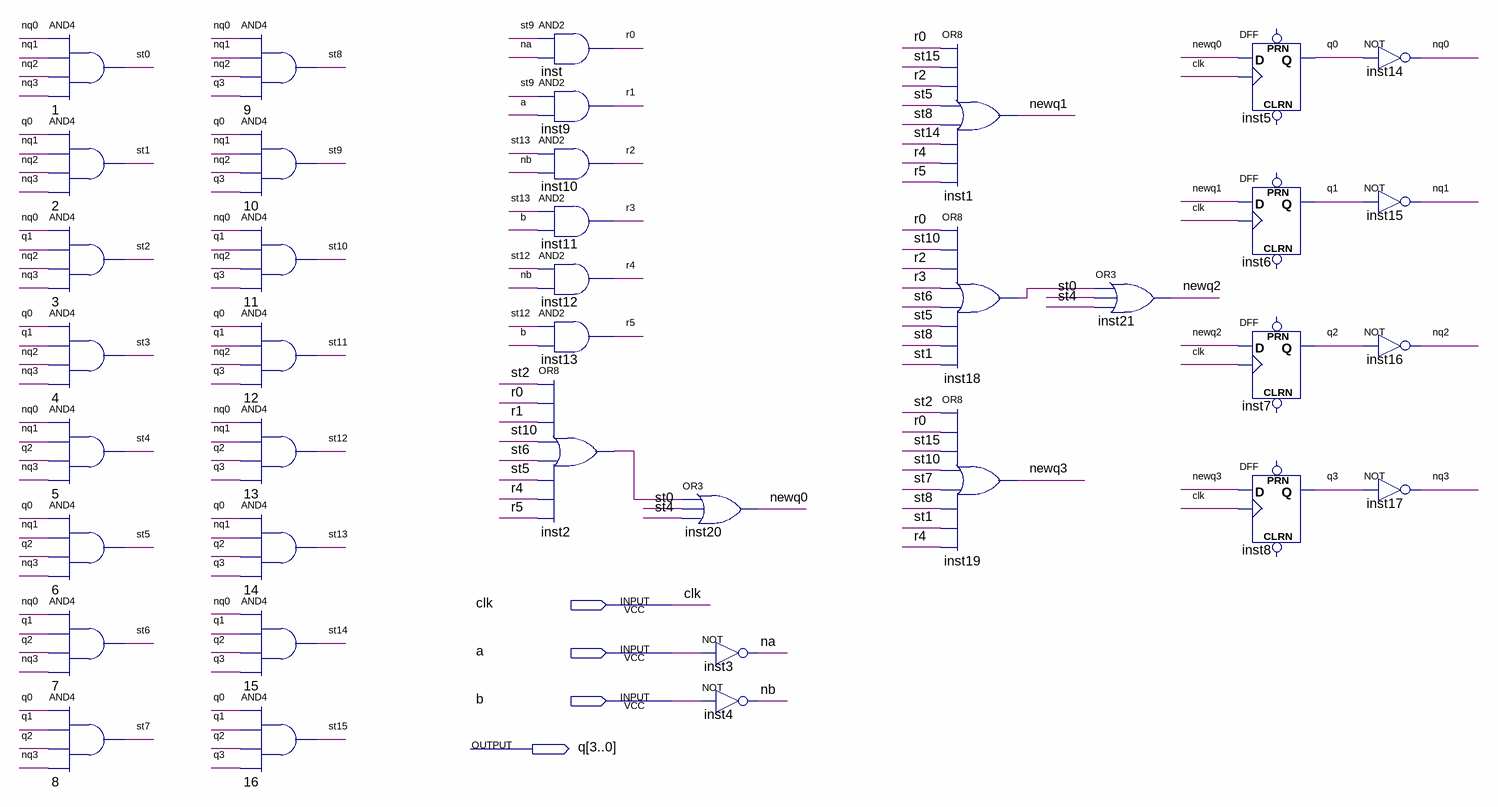
[diagram p0: schematic sheet]
// Quartus schematic praca6.bdf as structural Verilog: 38 symbols, 4 pins
module praca6 (
  input  clk,
  input  a,
  input  b,
  output [3:0] q
);

  wire inst2_out, inst18_out, na, nb, newq0, newq1, newq2, newq3, nq0, nq1, nq2, nq3, r0, r1, r2, r3, r4, r5,
       st0, st1, st2, st3, st4, st5, st6, st7, st8, st9, st10, st11, st12, st13, st14, st15;

  and u_1 (st0, nq0, nq1, nq2, nq3);
  and u_2 (st1, q[0], nq1, nq2, nq3);
  and u_3 (st2, nq0, q[1], nq2, nq3);
  and u_4 (st3, q[0], q[1], nq2, nq3);
  and u_5 (st4, nq0, nq1, q[2], nq3);
  and u_6 (st5, q[0], nq1, q[2], nq3);
  and u_7 (st6, nq0, q[1], q[2], nq3);
  and u_8 (st7, q[0], q[1], q[2], nq3);
  and u_9 (st8, nq0, nq1, nq2, q[3]);
  and u_10 (st9, q[0], nq1, nq2, q[3]);
  and u_11 (st10, nq0, q[1], nq2, q[3]);
  and u_12 (st11, q[0], q[1], nq2, q[3]);
  and u_13 (st12, nq0, nq1, q[2], q[3]);
  and u_14 (st13, q[0], nq1, q[2], q[3]);
  and u_15 (st14, nq0, q[1], q[2], q[3]);
  and u_16 (st15, q[0], q[1], q[2], q[3]);
  and inst (r0, st9, na);
  and inst9 (r1, st9, a);
  and inst10 (r2, st13, nb);
  and inst11 (r3, st13, b);
  and inst12 (r4, st12, nb);
  and inst13 (r5, st12, b);
  or inst2 (inst2_out, st2, r0, r1, st10, st6, st5, r4, r5);
  or inst20 (newq0, inst2_out, st0, st4);
  not inst3 (na, a);
  not inst4 (nb, b);
  or inst1 (newq1, r0, st15, r2, st5, st8, st14, r4, r5);
  or inst18 (inst18_out, r0, st10, r2, r3, st6, st5, st8, st1);
  or inst19 (newq3, st2, r0, st15, st10, st7, st8, st1, r4);
  or inst21 (newq2, inst18_out, st0, st4);
  DFF inst5 (.CLK(clk), .D(newq0), .Q(q[0]));  // open: CLRN, PRN
  DFF inst6 (.CLK(clk), .D(newq1), .Q(q[1]));  // open: CLRN, PRN
  DFF inst7 (.CLK(clk), .D(newq2), .Q(q[2]));  // open: CLRN, PRN
  DFF inst8 (.CLK(clk), .D(newq3), .Q(q[3]));  // open: CLRN, PRN
  not inst14 (nq0, q[0]);
  not inst15 (nq1, q[1]);
  not inst16 (nq2, q[2]);
  not inst17 (nq3, q[3]);
endmodule
